# EAGLE design TFG_sch (EAGLE 7.5.0)
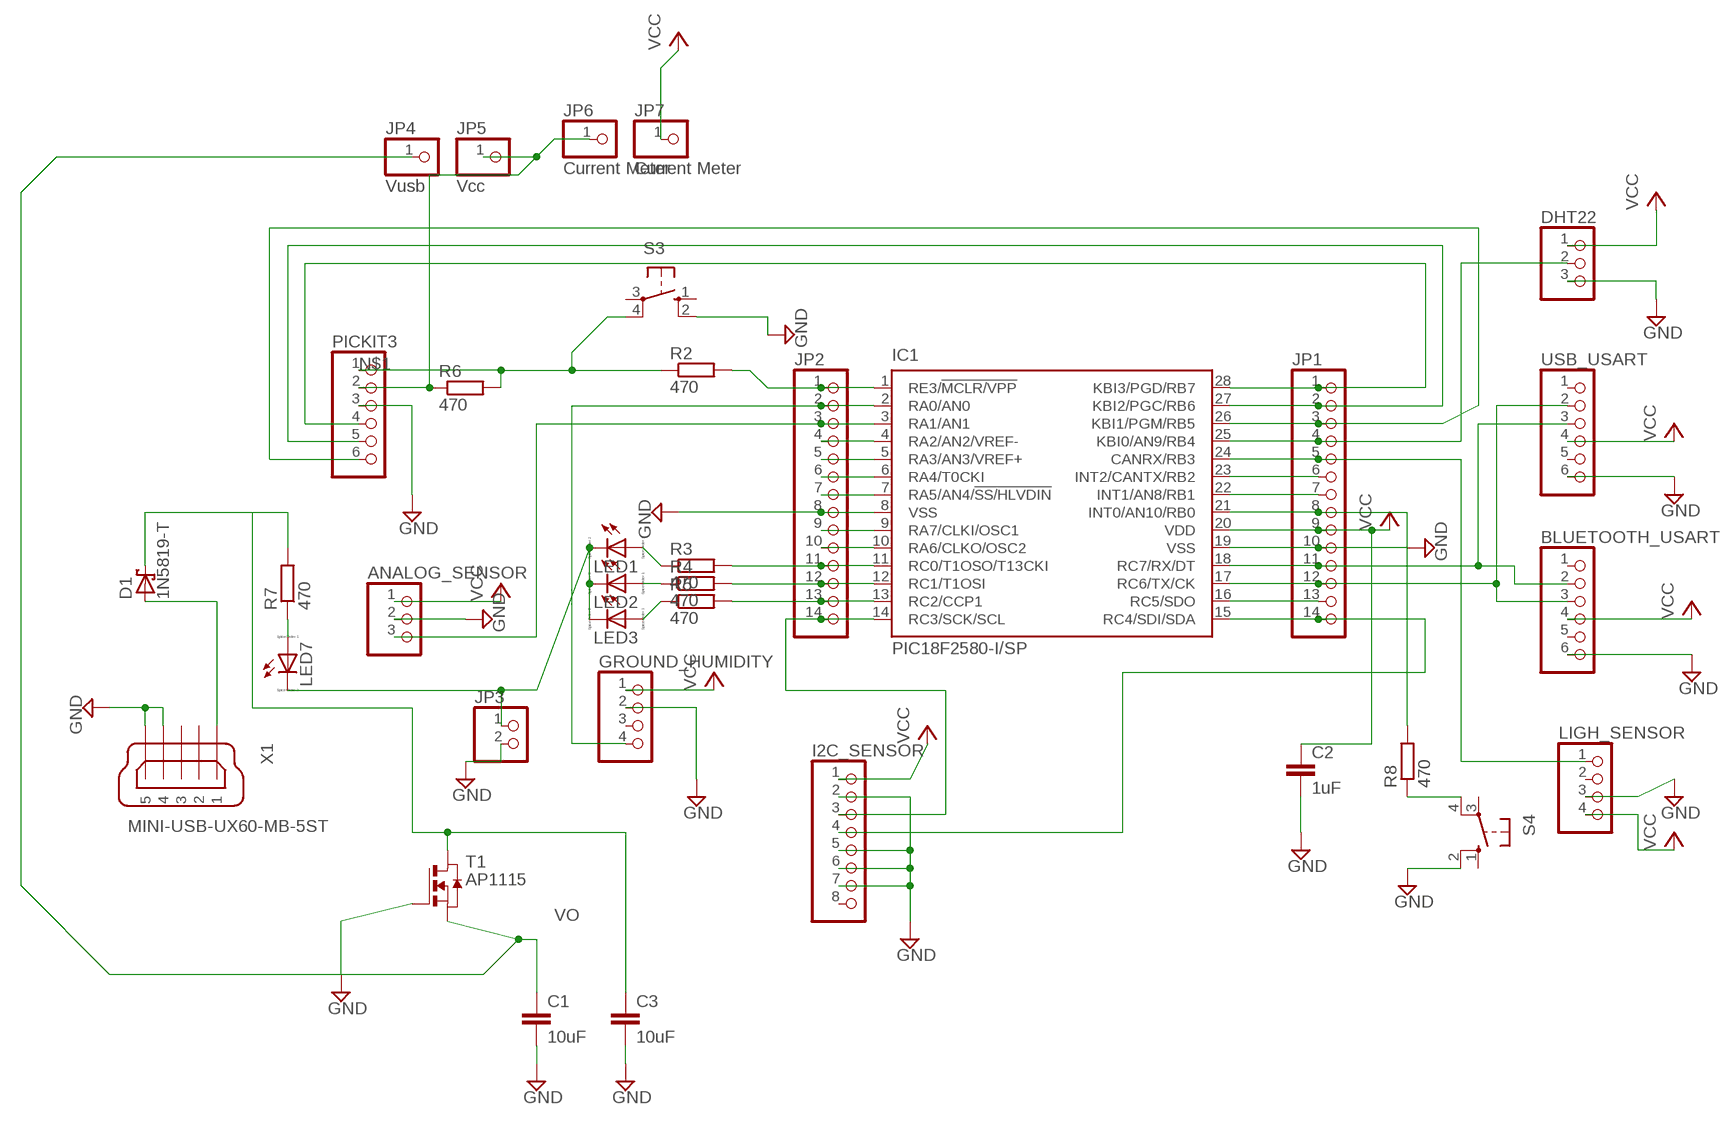
[diagram p0: schematic, sheet 1]

## Parts
ANALOG_SENSOR  PINHD-1X3  [1X03]
BLUETOOTH_USART  PINHD-1X6  [1X06]
C1  10uF  C-EUC1206  [C1206]
C2  1uF  C-EUC1206  [C1206]
C3  10uF  C-EUC1206  [C1206]
D1  1N5819-T  [DO41-7.6]
DHT22  PINHD-1X3  [1X03]
GROUND_HUMIDITY  PINHD-1X4  [1X04]
I2C_SENSOR  PINHD-1X8  [1X08]
IC1  PIC18F2580-I/SP  [DIL28-3]
JP1  PINHD-1X14  [1X14]
JP2  PINHD-1X14  [1X14]
JP3  PINHD-1X2  [1X02]
JP4  Vusb  PINHD-1X1  [1X01]
JP5  Vcc  PINHD-1X1  [1X01]
JP6  Current Meter  PINHD-1X1  [1X01]
JP7  Current Meter  PINHD-1X1  [1X01]
LED1  LED_E  [LED_1206]
LED2  LED_E  [LED_1206]
LED3  LED_E  [LED_1206]
LED7  LED_E  [LED_1206]
LIGH_SENSOR  PINHD-1X4  [1X04]
PICKIT3  PINHD-1X6/90  [1X06/90]
R2  470  R-EU_R1206  [R1206]
R3  470  R-EU_R1206  [R1206]
R4  470  R-EU_R1206  [R1206]
R5  470  R-EU_R1206  [R1206]
R6  470  R-EU_R1206  [R1206]
R7  470  R-EU_R1206  [R1206]
R8  470  R-EU_R1206  [R1206]
S3  10-XX  [B3F-10XX]
S4  10-XX  [B3F-10XX]
T1  AP1115  NMOSSOT89  [SOT89]
USB_USART  PINHD-1X6  [1X06]
X1  MINI-USB-UX60-MB-5ST  [UX60-MB-5ST]

## Nets
GND: ANALOG_SENSOR.2 BLUETOOTH_USART.6 C1.2 C2.2 C3.2 DHT22.3 GROUND_HUMIDITY.2 I2C_SENSOR.2 I2C_SENSOR.5 I2C_SENSOR.6 I2C_SENSOR.7 IC1.8(VSS) IC1.19(VSS) JP1.10 JP2.8 JP3.2 LIGH_SENSOR.3 PICKIT3.3 S3.2(S1) S4.2(S1) T1.1(G) USB_USART.6 X1.4 X1.5
N$1: PICKIT3.1 R2.1 R6.2 S3.4(P1)
N$2: GROUND_HUMIDITY.4 IC1.2(RA0/AN0) JP2.2
N$3: ANALOG_SENSOR.3 IC1.3(RA1/AN1) JP2.3
N$4: IC1.4(RA2/AN2/VREF-) JP2.4
N$5: IC1.5(RA3/AN3/VREF+) JP2.5
N$6: IC1.6(RA4/T0CKI) JP2.6
N$7: IC1.7(RA5/AN4/!SS/HLVDIN) JP2.7
N$8: I2C_SENSOR.3 IC1.14(RC3/SCK/SCL) JP2.14
N$9: IC1.9(RA7/CLKI/OSC1) JP2.9
N$10: IC1.10(RA6/CLKO/OSC2) JP2.10
N$11: IC1.11(RC0/T1OSO/T13CKI) JP2.11 R3.2
N$12: IC1.12(RC1/T1OSI) JP2.12 R4.2
N$13: IC1.13(RC2/CCP1) JP2.13 R5.2
N$15: IC1.28(KBI3/PGD/RB7) JP1.1 PICKIT3.4
N$16: IC1.27(KBI2/PGC/RB6) JP1.2 PICKIT3.5
N$17: IC1.26(KBI1/PGM/RB5) JP1.3
N$18: DHT22.2 IC1.25(KBI0/AN9/RB4) JP1.4
N$19: IC1.24(CANRX/RB3) JP1.5 LIGH_SENSOR.1
N$20: IC1.23(INT2/CANTX/RB2) JP1.6
N$21: IC1.22(INT1/AN8/RB1) JP1.7
N$22: IC1.21(INT0/AN10/RB0) JP1.8 R8.2
N$23: IC1.1(RE3/!MCLR/VPP) JP2.1 R2.2
N$24: R8.1 S4.4(P1)
N$25: BLUETOOTH_USART.2 IC1.18(RC7/RX/DT) JP1.11 USB_USART.3
N$26: BLUETOOTH_USART.3 IC1.17(RC6/TX/CK) JP1.12 USB_USART.2
N$27: IC1.16(RC5/SDO) JP1.13
N$28: I2C_SENSOR.4 IC1.15(RC4/SDI/SDA) JP1.14
N$29: PICKIT3.6
N$31: LED1.A R3.1
N$32: LED2.A R4.1
N$33: LED3.A R5.1
N$34: JP3.1 LED1.C LED2.C LED3.C LED7.C
N$35: LED7.A R7.1
N$36: D1.A X1.1
N$37: C3.1 D1.C R7.2 T1.2(D) T1.2@1(D)
N$38: JP5.1 JP6.1 PICKIT3.2 R6.1
VCC: ANALOG_SENSOR.1 BLUETOOTH_USART.4 C2.1 DHT22.1 GROUND_HUMIDITY.1 I2C_SENSOR.1 IC1.20(VDD) JP1.9 JP7.1 LIGH_SENSOR.4 USB_USART.4
VO: C1.1 JP4.1 T1.3(S)
Unconnected: BLUETOOTH_USART.1 BLUETOOTH_USART.5 GROUND_HUMIDITY.3 I2C_SENSOR.8 LIGH_SENSOR.2 S3.1(S) S3.3(P) S4.1(S) S4.3(P) USB_USART.1 USB_USART.5 X1.2 X1.3

## Library data of the parts
ANALOG_SENSOR DHT22 = pinhead:PINHD-1X3: PIN HEADER
BLUETOOTH_USART PICKIT3 USB_USART = pinhead:PINHD-1X6: PIN HEADER
C1-C3 = rcl:C-EU: CAPACITOR, European symbol
D1 = diode:1N581*: 1.0A SCHOTTKY BARRIER RECTIFIER Source: http://www.diodes.com/datasheets/ds23001.pdf
GROUND_HUMIDITY LIGH_SENSOR = pinhead:PINHD-1X4: PIN HEADER
I2C_SENSOR = pinhead:PINHD-1X8: PIN HEADER
IC1 = microchip:PIC18F2*80: 28-Pin Enhanced Flash Microcontrollers with ECAN(TM) Technology 10-Bit A/D and nanoWatt Technology Source: http://www.microchip.com .. 39637a.pdf; MF: MICROCHIP; MPN: PIC18F2580-I/SP; OC_FARNELL: 9321276; OC_NEWARK: 71J7244
JP1 JP2 = pinhead:PINHD-1X14: PIN HEADER
JP3 = pinhead:PINHD-1X2: PIN HEADER
JP4-JP7 = pinhead:PINHD-1X1: PIN HEADER
LED1-LED3 LED7 = eagle-ltspice:LED_E: LED Source: http://www.osram.convergy.de Source: www.luxeon.com Source: www.kingbright.com; SPICEMODEL: NONE; SPICEPREFIX: D; SPICETYPE: diode
R2-R8 = resistor:R-EU_: RESISTOR, European symbol
S3 S4 = switch-omron:10-XX: OMRON SWITCH; MPN: B3F-1000; OC_FARNELL: 176432; OC_NEWARK: 36M3542
T1 = zetex:NMOSSOT89: MOS FET; OC_FARNELL: unknown; OC_NEWARK: unknown
X1 = con-hirose:MINI-USB-: MINI USB Connector Source: http://www.hirose.co.jp/cataloge_hp/e24000019.pdf; OC_FARNELL: unknown; OC_NEWARK: unknown

## Net classes
0 PCB: width 0.004 mm

## Board
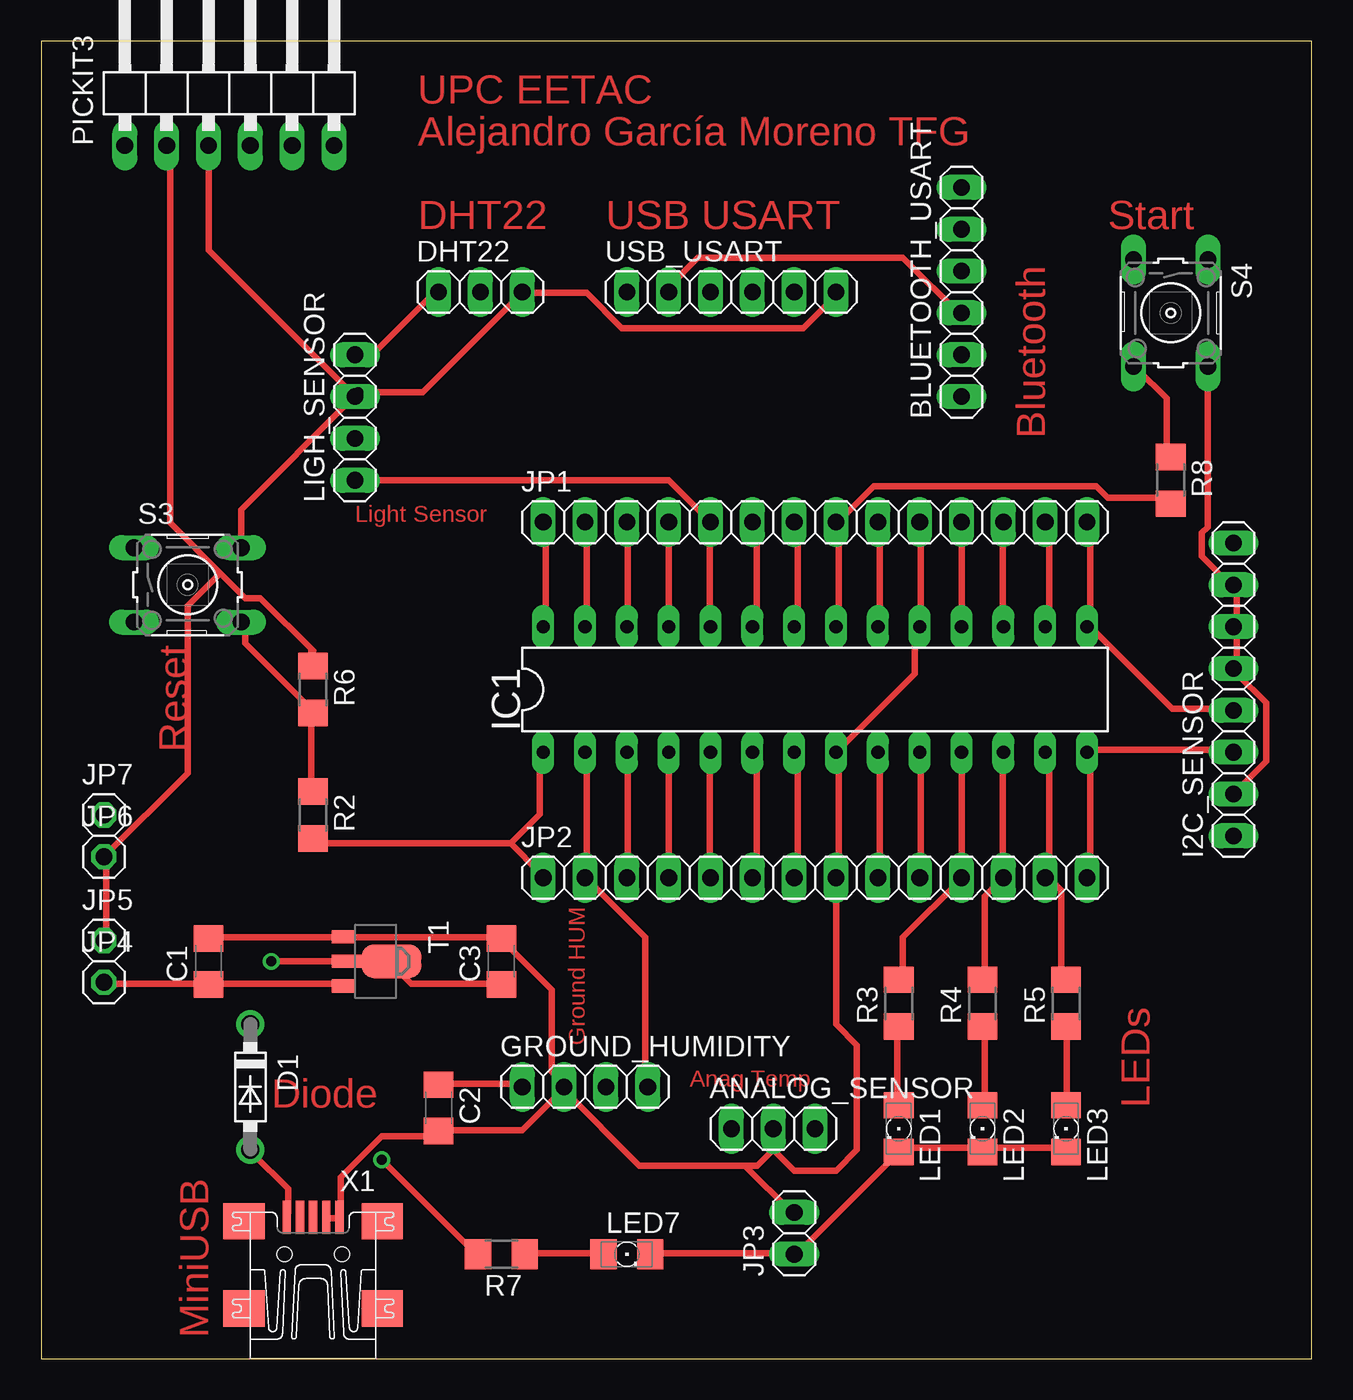
[diagram p1: board, top side]
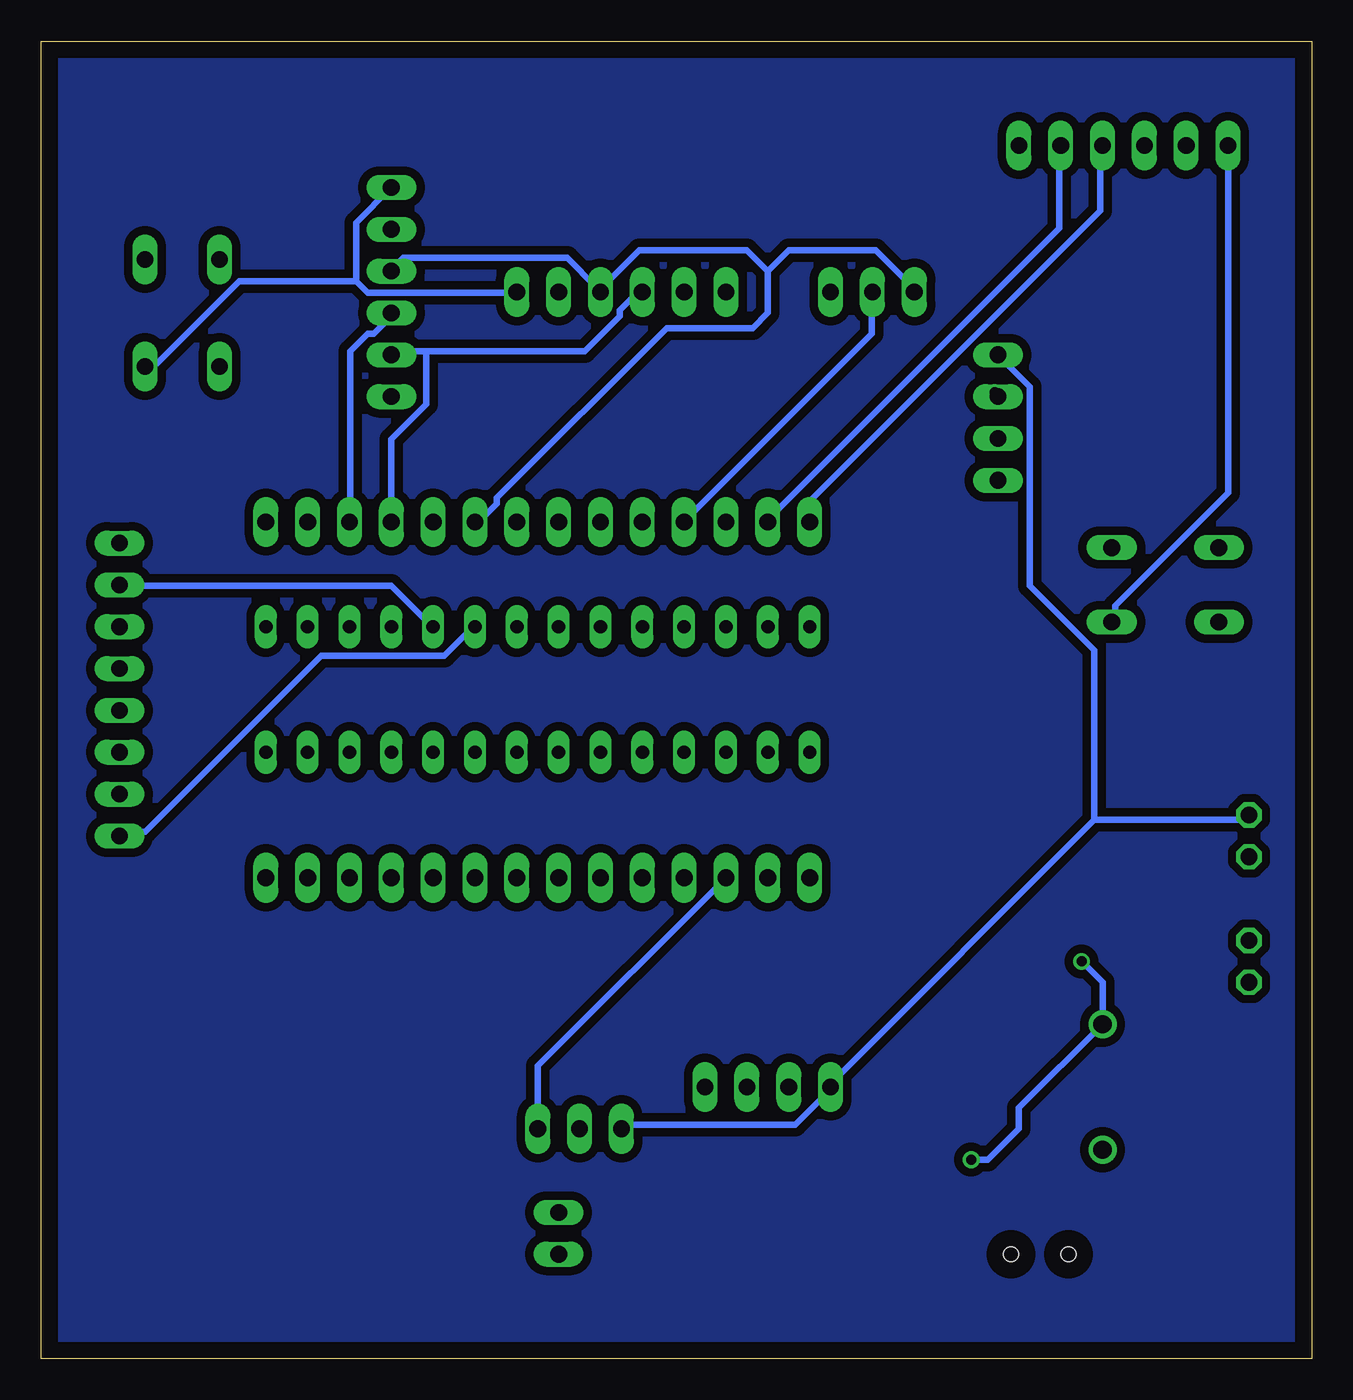
[diagram p2: board, bottom side, seen from below]

Size 77.14 x 80 mm. Coordinates in mm from the lower left corner, seen from the top.
Outline: 0,0 77.14,0 77.14,80 0,80 0,0
Copper layers (1*16): Top 0.035mm / dielectric 1.5mm / Bottom 0.035mm
Design rules "default *": minimum track width 16mil, minimum drill 24mil, track to track 20mil, track to pad 8mil, pad to pad 8mil, via to via 8mil, smd to smd 8mil, copper to edge 40mil, drill to drill 8mil, minimum pad ring 10mil, minimum via ring 8mil, stop-mask expansion 4mil, vias tented up to drill 0mil, thermal gap 10mil

### Footprints (pad centres in the part's own frame; a part is rotated, then mirrored left to right if it is on the bottom)
1X03 = drill 1.016 long: 1 -2.54,0; 2 0,0; 3 2.54,0
1X06 = drill 1.016 long: 1 -6.35,0; 2 -3.81,0; 3 -1.27,0; 4 1.27,0; 5 3.81,0; 6 6.35,0
C1206 = smd 1.6 x 1.8: 1 -1.4,0; 2 1.4,0
DO41-7.6 = drill 1.1 pad 1.7: A 3.81,0; C -3.81,0
1X04 = drill 1.016 long: 1 -3.81,0; 2 -1.27,0; 3 1.27,0; 4 3.81,0
1X08 = drill 1.016 long: 1 -8.89,0; 2 -6.35,0; 3 -3.81,0; 4 -1.27,0; 5 1.27,0; 6 3.81,0; 7 6.35,0; 8 8.89,0
DIL28-3 = drill 0.813 long: 1 -16.51,-3.81; 2 -13.97,-3.81; 3 -11.43,-3.81; 4 -8.89,-3.81; 5 -6.35,-3.81; 6 -3.81,-3.81; 7 -1.27,-3.81; 8 1.27,-3.81; 9 3.81,-3.81; 10 6.35,-3.81; 11 8.89,-3.81; 12 11.43,-3.81; 13 13.97,-3.81; 14 16.51,-3.81; 15 16.51,3.81; 16 13.97,3.81; 17 11.43,3.81; 18 8.89,3.81; 19 6.35,3.81; 20 3.81,3.81; 21 1.27,3.81; 22 -1.27,3.81; 23 -3.81,3.81; 24 -6.35,3.81; 25 -8.89,3.81; 26 -11.43,3.81; 27 -13.97,3.81; 28 -16.51,3.81
1X14 = drill 1.016 long: 1 -16.51,0; 2 -13.97,0; 3 -11.43,0; 4 -8.89,0; 5 -6.35,0; 6 -3.81,0; 7 -1.27,0; 8 1.27,0; 9 3.81,0; 10 6.35,0; 11 8.89,0; 12 11.43,0; 13 13.97,0; 14 16.51,0
1X02 = drill 1.016 long: 1 -1.27,0; 2 1.27,0
1X01 = drill 1.016 octagon: 1 0,0
LED_1206 = smd 1.6 x 1.803: A -1.422,0; C 1.422,0
1X06/90 = drill 1.016 long: 1 -6.35,-3.81; 2 -3.81,-3.81; 3 -1.27,-3.81; 4 1.27,-3.81; 5 3.81,-3.81; 6 6.35,-3.81
R1206 = smd 1.6 x 1.803: 1 -1.422,0; 2 1.422,0
B3F-10XX = drill 1.016 long: 1 -3.251,2.261; 2 3.251,2.261; 3 -3.251,-2.261; 4 3.251,-2.261
SOT89 = smd 0.8 x 1.4: 1 -1.499,-1.981; 3 1.499,-1.981 | smd 0.8 x 1.9: 2 0,-1.727 | smd 2.032 x 3.65: 2@1 0,0.94
UX60-MB-5ST = smd 2 x 0.5: 1 2.25,1.6; 2 2.25,0.8; 3 2.25,0; 4 2.25,-0.8; 5 2.25,-1.6 | smd 2.2 x 2.5: M1 -3.3,-4.2; M2 -3.3,4.2; M3 2,4.2; M4 2,-4.2 | hole 0.9: 0,-1.75; 0,1.75

### Placement (x,y rotation side)
ANALOG_SENSOR  44.45,13.97 0 top
BLUETOOTH_USART  55.88,64.77 90 top
C1  10.16,24.13 90 top
C2  24.13,15.24 270 top
C3  27.94,24.13 90 top
D1  12.7,16.51 270 top
DHT22  26.67,64.77 0 top
GROUND_HUMIDITY  33.02,16.51 0 top
I2C_SENSOR  72.39,40.64 90 top
IC1  46.99,40.64 0 top
JP1  46.99,50.8 0 top
JP2  46.99,29.21 0 top
JP3  45.72,7.62 90 top
JP4  3.81,22.86 0 top
JP5  3.81,25.4 0 top
JP6  3.81,30.48 0 top
JP7  3.81,33.02 0 top
LED1  52.07,13.97 270 top
LED2  57.15,13.97 270 top
LED3  62.23,13.97 270 top
LED7  35.56,6.35 0 top
LIGH_SENSOR  19.05,57.15 90 top
PICKIT3  11.43,77.47 0 top
R2  16.51,33.02 270 top
R3  52.07,21.59 90 top
R4  57.15,21.59 90 top
R5  62.23,21.59 90 top
R6  16.51,40.64 270 top
R7  27.94,6.35 180 top
R8  68.58,53.34 270 top
S3  8.89,46.99 0 top
S4  68.58,63.5 270 top
T1  20.32,24.13 270 top
USB_USART  41.91,64.77 0 top
X1  16.51,6.35 90 top

### Tracks (layer width: path | path; a pad name or v marks a point on that pad's centre or on a via)
GND  (via drill 0.6)
  Top 0.406: C1.2 10.36,25.6 18.19,25.6 T1.1 18.54,25.6 27.79,25.6 C3.2 28.14,25.25 30.99,22.4 30.99,17.42 31.7,16.71 GROUND_HUMIDITY.2 31.7,16.36 | 44.5,13.87 ANALOG_SENSOR.2 44.45,12.7 | JP3.2 45.57,8.89 42.72,11.73 | X1.4 17.48,8.53 18.19,8.53 X1.5 18.19,8.89 18.19,11.02 20.68,13.51 23.88,13.51 C2.2 24.23,13.87 29.21,13.87 31.7,16.36 | 31.7,16.36 36.32,11.73 42.72,11.73 | S3.2 12.14,51.56 18.9,58.32 LIGH_SENSOR.3 v19.25,58.67 | 29.21,64.72 23.16,58.67 v19.25,58.67 | JP1.10 53.39,50.49 53.39,44.45 IC1.19 53.03,44.45 53.03,41.6 IC1.8 48.41,36.63 48.41,29.52 JP2.8 | I2C_SENSOR.2 74.37,36.27 74.37,39.83 72.59,41.6 I2C_SENSOR.5 72.59,41.96 72.59,44.45 | 72.59,44.45 72.59,46.94 I2C_SENSOR.7 72.24,46.94 70.46,48.72 70.46,50.14 70.82,50.49 70.82,60.1 S4.2 | 72.59,44.45 I2C_SENSOR.6 | 29.21,64.72 33.12,64.72 35.25,62.59 46.28,62.59 48.41,64.72 USB_USART.6 | 29.21,64.72 DHT22.3 | 48.41,29.16 JP2.8 | 42.72,11.73 43.48,11.73 44.45,12.7 | 44.45,12.7 45.72,11.43 48.26,11.43 49.53,12.7 49.53,19.05 48.26,20.32 JP2.8 | v19.25,58.67 18.8,58.67 10.16,67.31 PICKIT3.3
  Bottom 0.406: 58.01,65.43 57.3,64.72 48.41,64.72 USB_USART.6 | 58.01,65.43 58.01,68.99 BLUETOOTH_USART.6 | 58.01,65.43 65.13,65.43 70.1,60.45 70.82,60.45 S4.2 | IC1.19 53.39,44.45 55.88,46.94 72.24,46.94 I2C_SENSOR.7
N$1
  Top 0.406: R2.1 16.41,34.49 16.41,39.12 R6.2 16.51,39.32 12.4,43.43 12.4,44.35 S3.4 | 5.38,73.61 PICKIT3.1
  Bottom 0.406: PICKIT3.1 5.08,52.58 11.94,45.72 11.94,44.81 S3.4
N$2
  Top 0.406: IC1.2 33.12,36.63 33.12,29.52 JP2.2 33.12,29.16 36.68,25.6 36.68,16.71 GROUND_HUMIDITY.4
N$3
  Top 0.406: IC1.3 35.61,36.63 35.61,29.52 JP2.3
  Bottom 0.406: ANALOG_SENSOR.3 46.99,17.78 JP2.3
N$4
  Top 0.406: JP2.4 IC1.4
N$5
  Top 0.406: IC1.5 40.59,36.63 40.59,29.52 JP2.5
N$6
  Top 0.406: IC1.6 43.43,36.63 43.43,29.52 JP2.6
N$7
  Top 0.406: IC1.7 45.92,36.63 45.92,29.52 JP2.7
N$8
  Top 0.406: JP2.14 63.7,29.52 63.7,36.63 IC1.14 63.7,36.98 72.24,36.98 I2C_SENSOR.3
N$9
  Top 0.406: IC1.9 50.9,36.63 50.9,29.52 JP2.9
N$10
  Top 0.406: IC1.10 53.39,36.63 53.39,29.52 JP2.10
N$11
  Top 0.406: R3.2 52.32,23.11 52.32,25.6 55.88,29.16 JP2.11 IC1.11
N$12
  Top 0.406: R4.2 57.3,23.11 57.3,28.09 JP2.12 58.37,29.52 58.37,36.63 IC1.12
N$13
  Top 0.406: R5.2 61.93,23.11 61.93,28.45 61.21,29.16 JP2.13 61.21,29.52 61.21,36.63 IC1.13
N$14
  pour Bottom: 0,80.01 77.47,80.01 77.47,0 0,0
N$15
  Top 0.406: IC1.28 30.63,44.45 30.63,50.49 JP1.1
  Bottom 0.406: PICKIT3.4 12.85,73.61 12.85,69.7 30.28,52.27 30.28,50.85 JP1.1
N$16
  Top 0.406: IC1.27 33.12,44.45 33.12,50.49 JP1.2
  Bottom 0.406: PICKIT3.5 15.34,73.61 15.34,68.63 33.12,50.85 JP1.2
N$17
  Top 0.406: IC1.26 35.61,44.45 35.61,50.49 JP1.3
N$18
  Top 0.406: JP1.4 IC1.25
  Bottom 0.406: DHT22.2 26.72,64.72 26.72,62.23 38.1,50.85 JP1.4
N$19
  Top 0.406: IC1.24 40.59,44.45 40.59,50.49 JP1.5 38.1,53.34 LIGH_SENSOR.1
N$20
  Top 0.406: IC1.23 43.43,44.45 43.43,50.49 JP1.6
N$21
  Top 0.406: IC1.22 45.92,44.45 45.92,50.49 JP1.7
N$22
  Top 0.406: R8.2 68.33,52.27 64.77,52.27 64.06,52.98 50.55,52.98 48.41,50.85 JP1.8 48.41,50.49 48.41,44.45 IC1.21
N$23
  Top 0.406: 28.5,31.29 16.76,31.29 R2.2 | 28.5,31.29 30.28,29.52 JP2.1 | 28.5,31.29 30.28,33.07 30.28,36.63 IC1.1
N$24
  Top 0.406: R8.1 68.33,54.76 68.33,58.32 66.55,60.1 S4.4
N$25
  Top 0.406: JP1.11 IC1.18
  Bottom 0.406: 53.75,61.16 55.88,61.16 BLUETOOTH_USART.2 | 53.75,61.16 44.14,61.16 42.01,63.3 42.01,63.65 40.95,64.72 USB_USART.3 | JP1.11 55.88,55.83 53.75,57.96 53.75,61.16
N$26
  Top 0.406: IC1.17 58.37,44.45 58.37,50.49 JP1.12 | USB_USART.2 38.1,65.08 39.88,66.85 52.32,66.85 55.88,63.3 BLUETOOTH_USART.3
  Bottom 0.406: BLUETOOTH_USART.3 55.88,63.3 56.95,62.23 57.3,62.23 58.37,61.16 58.37,50.85 JP1.12
N$27
  Top 0.406: IC1.16 61.21,44.45 61.21,50.49 JP1.13
N$28
  Top 0.406: 63.7,44.45 63.7,50.49 JP1.14 | 63.7,44.45 68.68,39.47 72.24,39.47 I2C_SENSOR.4 | 63.7,44.45 IC1.15
N$31
  Top 0.406: LED1.A 51.97,15.65 51.97,19.91 R3.1
N$32
  Top 0.406: LED2.A 57.3,15.65 57.3,19.91 R4.1
N$33
  Top 0.406: LED3.A 62.28,15.65 62.28,19.91 R5.1
N$34
  Top 0.406: LED3.C 61.93,12.8 57.3,12.8 LED2.C 56.95,12.8 52.32,12.8 LED1.C 51.97,12.45 45.92,6.4 JP3.1 45.57,6.4 37.03,6.4 LED7.C
N$35
  Top 0.406: R7.1 29.57,6.4 33.83,6.4 LED7.A
N$36
  Top 0.406: X1.1 14.99,8.89 14.99,10.31 12.85,12.45 D1.A
N$37  (via drill 0.6, 0.61)
  Top 0.406: C3.1 27.79,22.76 22.45,22.76 21.39,23.82 T1.2@1 | v20.68,12.09 26.37,6.4 R7.2 | v13.97,24.13 T1.2
  Bottom 0.406: v13.97,24.13 12.7,22.86 D1.C 17.78,15.24 17.78,13.97 19.66,12.09 v20.68,12.09
N$38
  Top 0.406: JP5.1 3.96,25.6 3.96,30.23 JP6.1 8.89,35.56 8.89,45.72 10.87,47.7 | 16.41,42.98 16.41,42.32 R6.1 | 16.41,42.98 16.41,43.03 | 7.87,73.61 PICKIT3.2 7.82,73.61 7.82,50.75 10.87,47.7 | 10.87,47.7 12.4,46.18 13.31,46.18 16.51,42.98 16.41,42.98
VCC
  Top 0.406: C2.1 24.23,16.71 29.21,16.71 GROUND_HUMIDITY.1 | IC1.20 50.9,44.45 50.9,50.49 JP1.9 | LIGH_SENSOR.4 19.25,61.16 20.32,61.16 23.88,64.72 DHT22.1
  Bottom 0.406: 13.21,32.72 3.96,32.72 JP7.1 | 13.21,32.72 29.21,16.71 GROUND_HUMIDITY.1 29.21,16.36 31.34,14.22 41.66,14.22 ANALOG_SENSOR.1 | I2C_SENSOR.1 72.24,32 70.82,32 60.15,42.67 52.68,42.67 50.9,44.45 IC1.20 | BLUETOOTH_USART.4 55.88,66.14 55.17,66.85 45.21,66.85 43.43,65.08 USB_USART.4 43.08,65.08 40.84,67.31 34.29,67.31 33.02,66.04 | DHT22.1 24.23,65.08 26.47,67.31 31.75,67.31 33.02,66.04 | JP1.9 50.55,50.85 49.48,51.92 49.48,52.27 39.17,62.59 33.93,62.59 33.02,63.5 33.02,66.04 | 13.21,32.72 13.21,43.03 17.12,46.94 17.12,59.03 LIGH_SENSOR.4
VO
  Top 0.406: T1.3 18.19,22.76 10.36,22.76 C1.1 10.01,22.76 3.96,22.76 JP4.1

### Text on the board
Top: UPC EETAC | Alejandro García Moreno TFG | DHT22 | USB USART | Start | Bluetooth | Light Sensor | Reset | Ground HUM | Anag Temp | Diode | LEDs | MiniUSB